# Altium schematic sheet boost schematic.SchDoc
size A
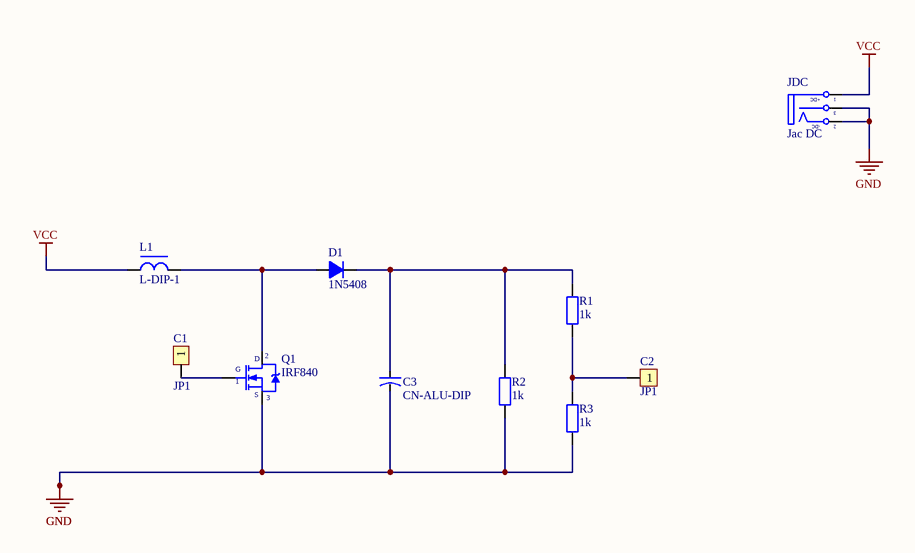
[diagram p0: boost schematic.SchDoc]

## Parts
C1  JP1  [JP1-D1T]
C2  JP1  [JP1-D1T]
C3  CN-ALU-DIP  [CA-ALU-2.54]
D1  1N5408  [D5A]
JDC  Jac DC  [DC-IN]
L1  L-DIP-1  [L-DIP-M-5.3]
Q1  IRF840  [QTO-220]
R1  1k  [R1/4W]
R2  1k  [R1/4W]
R3  1k  [R1/4W]

## Nets
GND: C3.2 JDC.2(TN) JDC.3(S) Q1.3(S) R2.2 R3.2
VCC: JDC.1(T) L1.1
NetC1_1: C1.1 Q1.1(G)
NetC2_1: C2.1 R1.2 R3.1
NetC3_1: C3.1 D1.2(K) R1.1 R2.1
NetD1_1: D1.1(A) L1.2 Q1.2(D)

## Notes on the sheet
- (in symbol DCIN) +DC; -DC

## Library data of the parts
C1 C2 = JP1: WR-PHD 2.54 mm Angled Socket Header; Manufacturer: W¨¹rth Elektronik eiSos GmbH; partNo: 613002143121; ComponentLink1 Description: Manufacturer; ComponentLink2 Description: Datasheet; NoPins: 02; Created Date: 29 March 2013; ComponentLink1URL: http://www.we-online.com; ComponentLink2URL: http://katalog.we-online.de/em/datasheet/6130xx143121.pdf; Created by: Karrer Zheng
C3 = CN-ALU-DIP: Capacitor (Semiconductor SIM Model); Value: 104; LatestRevisionDate: 17-Jul-2002; LatestRevisionNote: Re-released for DXP Platform.; PackageReference: C1206; Publisher: Altium Limited
D1 = D5A: Diode 5A; Value: 1N5408
JDC = DCIN: Jac DC input; Value: Jac DC
L1 = L-DIP-1: Inductor; Value: 150 mH
Q1 = IRF840: MOSFET N - CHANNEL 500V - 0.75 - 8A - TO-220; Value: IRF840
R1-R3 = R1/4W: Resistor 1/4W; Value: R1/4W - 1K